# EAGLE design dac-v20_opamp (EAGLE 6.2)
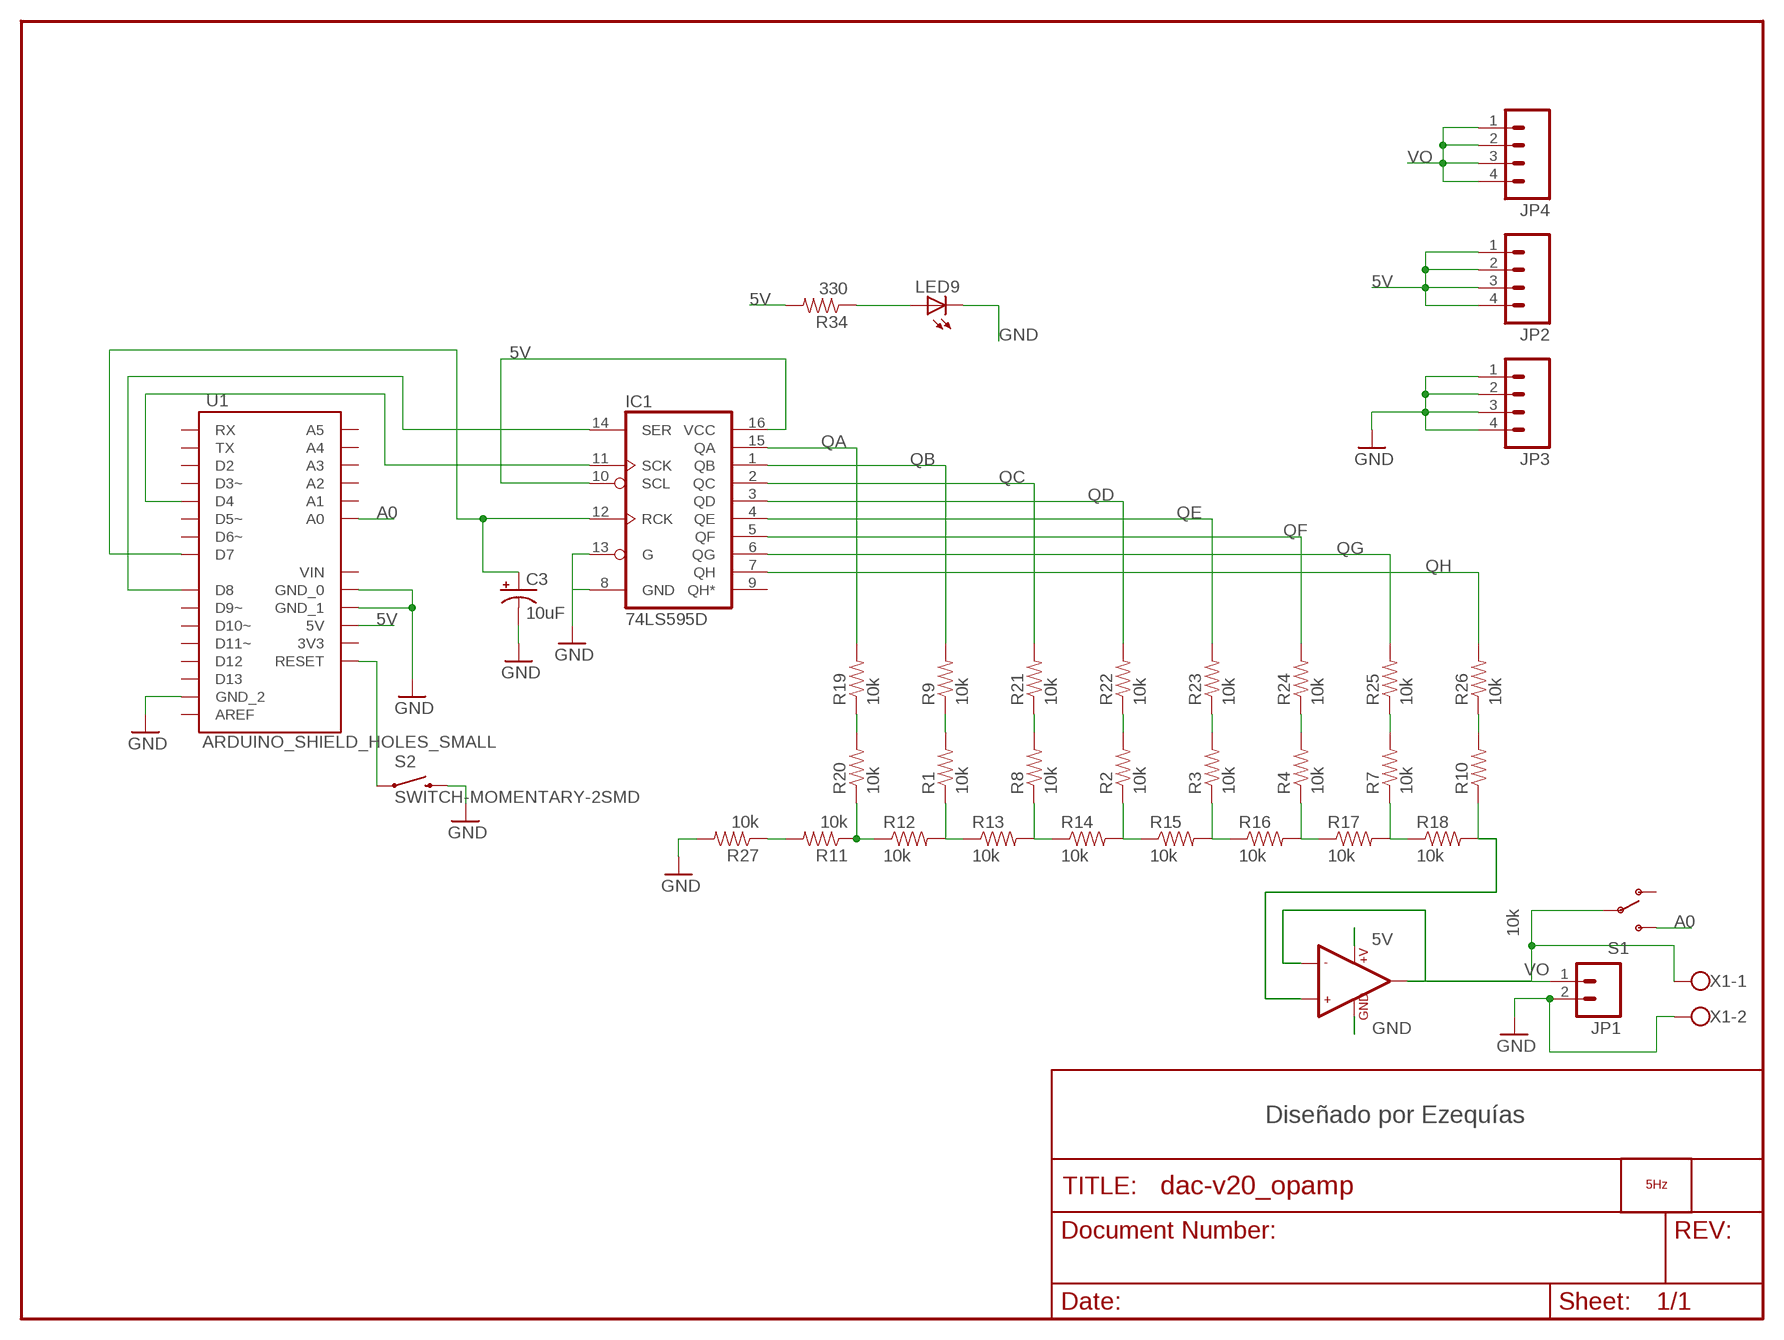
[diagram p0: schematic, sheet 1]

## Parts
C3  10uF  CAP_POL1206  [EIA3216]
IC1  74LS595D  [SO16]
JP1  M02POLAR  [MOLEX-1X2]
JP2  M04PTH  [1X04]
JP3  M04PTH  [1X04]
JP4  M04PTH  [1X04]
LED9  LED0603  [LED-0603]
LOGO2  LOGO_5HZ_H_20MM  [5HZ_LOGO_H_20MM]
R1  10k  RESISTOR0603-RES  [0603-RES]
R2  10k  RESISTOR0603-RES  [0603-RES]
R3  10k  RESISTOR0603-RES  [0603-RES]
R4  10k  RESISTOR0603-RES  [0603-RES]
R7  10k  RESISTOR0603-RES  [0603-RES]
R8  10k  RESISTOR0603-RES  [0603-RES]
R9  10k  RESISTOR0603-RES  [0603-RES]
R10  10k  RESISTOR0603-RES  [0603-RES]
R11  10k  RESISTOR0603-RES  [0603-RES]
R12  10k  RESISTOR0603-RES  [0603-RES]
R13  10k  RESISTOR0603-RES  [0603-RES]
R14  10k  RESISTOR0603-RES  [0603-RES]
R15  10k  RESISTOR0603-RES  [0603-RES]
R16  10k  RESISTOR0603-RES  [0603-RES]
R17  10k  RESISTOR0603-RES  [0603-RES]
R18  10k  RESISTOR0603-RES  [0603-RES]
R19  10k  RESISTOR0603-RES  [0603-RES]
R20  10k  RESISTOR0603-RES  [0603-RES]
R21  10k  RESISTOR0603-RES  [0603-RES]
R22  10k  RESISTOR0603-RES  [0603-RES]
R23  10k  RESISTOR0603-RES  [0603-RES]
R24  10k  RESISTOR0603-RES  [0603-RES]
R25  10k  RESISTOR0603-RES  [0603-RES]
R26  10k  RESISTOR0603-RES  [0603-RES]
R27  10k  RESISTOR0603-RES  [0603-RES]
R34  330  RESISTOR0603-RES  [0603-RES]
S1  SWITCH-SPSTPTH  [SWITCH-SPDT]
S2  SWITCH-MOMENTARY-2SMD  [TACTILE_SWITCH_SMD]
U1  ARDUINO_SHIELD_HOLES_SMALL  [UNO_SHIELD_SMALL_HOLES]
U$1  LMV358  [SO08]
X1  W237-102M2  [W237-102]

## Nets
5V: IC1.10(SCL) IC1.16(VCC) JP2.1 JP2.2 JP2.3 JP2.4 R34.2 U1.5V U$1.8(+V)
A0: S1.3(S) U1.A0
GND: C3.C(-) IC1.8(GND) IC1.13(G) JP1.2 JP3.1 JP3.2 JP3.3 JP3.4 LED9.C R27.2 S2.3 U1.GND_0 U1.GND_1 U1.GND_2 U$1.4(GND) X1.2
N$1: IC1.14(SER) U1.D8
N$2: S2.1 U1.RES(RESET)
N$3: IC1.11(SCK) U1.D4
N$6: C3.A(+) IC1.12(RCK) U1.D7
N$7: LED9.A R34.1
N$9: R10.1 R18.2 U$1.3(+IN1)
N$14: R11.1 R12.1 R20.1
N$15: R1.1 R12.2 R13.1
N$16: R8.1 R13.2 R14.1
N$20: R2.1 R14.2 R15.1
N$22: R3.1 R15.2 R16.1
N$23: R19.1 R20.2
N$24: R1.2 R9.1
N$25: R4.1 R16.2 R17.1
N$26: R8.2 R21.1
N$27: R7.1 R17.2 R18.1
N$29: R10.2 R26.1
N$30: R7.2 R25.1
N$31: R4.2 R24.1
N$32: R3.2 R23.1
N$33: R2.2 R22.1
N$34: R11.2 R27.1
QA: IC1.15(QA) R19.2
QB: IC1.1(QB) R9.2
QC: IC1.2(QC) R21.2
QD: IC1.3(QD) R22.2
QE: IC1.4(QE) R23.2
QF: IC1.5(QF) R24.2
QG: IC1.6(QG) R25.2
QH: IC1.7(QH) R26.2
VO: JP1.1 JP4.1 JP4.2 JP4.3 JP4.4 S1.2(P) U$1.1(OUT1) U$1.2(-IN1) X1.1
Unconnected: IC1.9(QH*) S1.1(O) U1.3.3V(3V3) U1.A1 U1.A2 U1.A3 U1.A4 U1.A5 U1.AREF U1.D2 U1.D3(D3~) U1.D5(D5~) U1.D6(D6~) U1.D9(D9~) U1.D10(D10~) U1.D11(D11~) U1.D12 U1.D13 U1.RX U1.TX U1.VIN U$1.5(+IN2) U$1.6(-IN2) U$1.7(OUT2)

## Notes on the sheet
- Diseñado por Ezequías

## Library data of the parts
C3 = SparkFun:CAP_POL: Capacitor Polarized These are standard SMD and PTH capacitors. Normally 10uF, 47uF, and 100uF in electrolytic and tantalum varieties. Always verify the external diameter of the through hole cap, it varies with capacity, voltage, and manufacturer. The EIA devices should be standard.
IC1 = SparkFun:74*595: 8-bit SHIFT REGISTER, output latch
JP1 = SparkFun:M02: Header 2 Standard 2-pin 0.1" header. Use with straight break away headers (SKU : PRT-00116), right angle break away headers (PRT-00553), swiss pins (PRT-00743), machine pins (PRT-00117), and female headers (PRT-00115). Molex polarized connector foot print use with SKU : PRT-08233 with associated crimp pins and housings.
JP2-JP4 = SparkFun:M04: Header 4 Standard 4-pin 0.1" header. Use with straight break away headers (SKU : PRT-00116), right angle break away headers (PRT-00553), swiss pins (PRT-00743), machine pins (PRT-00117), and female headers (PRT-00115). Molex polarized connector foot print use with SKU : PRT-08231 with associated crimp pins and housings. 1MM SMD Version SKU: PRT-10208
LED9 = SparkFun:LED: LEDs Standard schematic elements and footprints for 5mm, 3mm, 1206, and 0603 sized LEDs. 5mm - Spark Fun Electronics SKU : COM-00529 (and others)
LOGO2 = 5hz-electronica:LOGO_5HZ: Logotipo 5Hz "según Pedro"
R1-R4 R7-R27 R34 = SparkFun:RESISTOR: Resistor Basic schematic elements and footprints for 0603, 1206, and PTH resistors.
S1 = SparkFun:SWITCH-SPST: SPST Switch Simple slide switch. Spark Fun Electronics SKU : COM-00102
S2 = SparkFun:SWITCH-MOMENTARY-2
U1 = 5hz-electronica:ARDUINO_SHIELD
U$1 = memory-atmel-2:LMV358
X1 = PEDRO:W237-102: WAGO SCREW CLAMP; MPN: 237-102; OC_FARNELL: unknown; OC_NEWARK: 70K9898

## Board
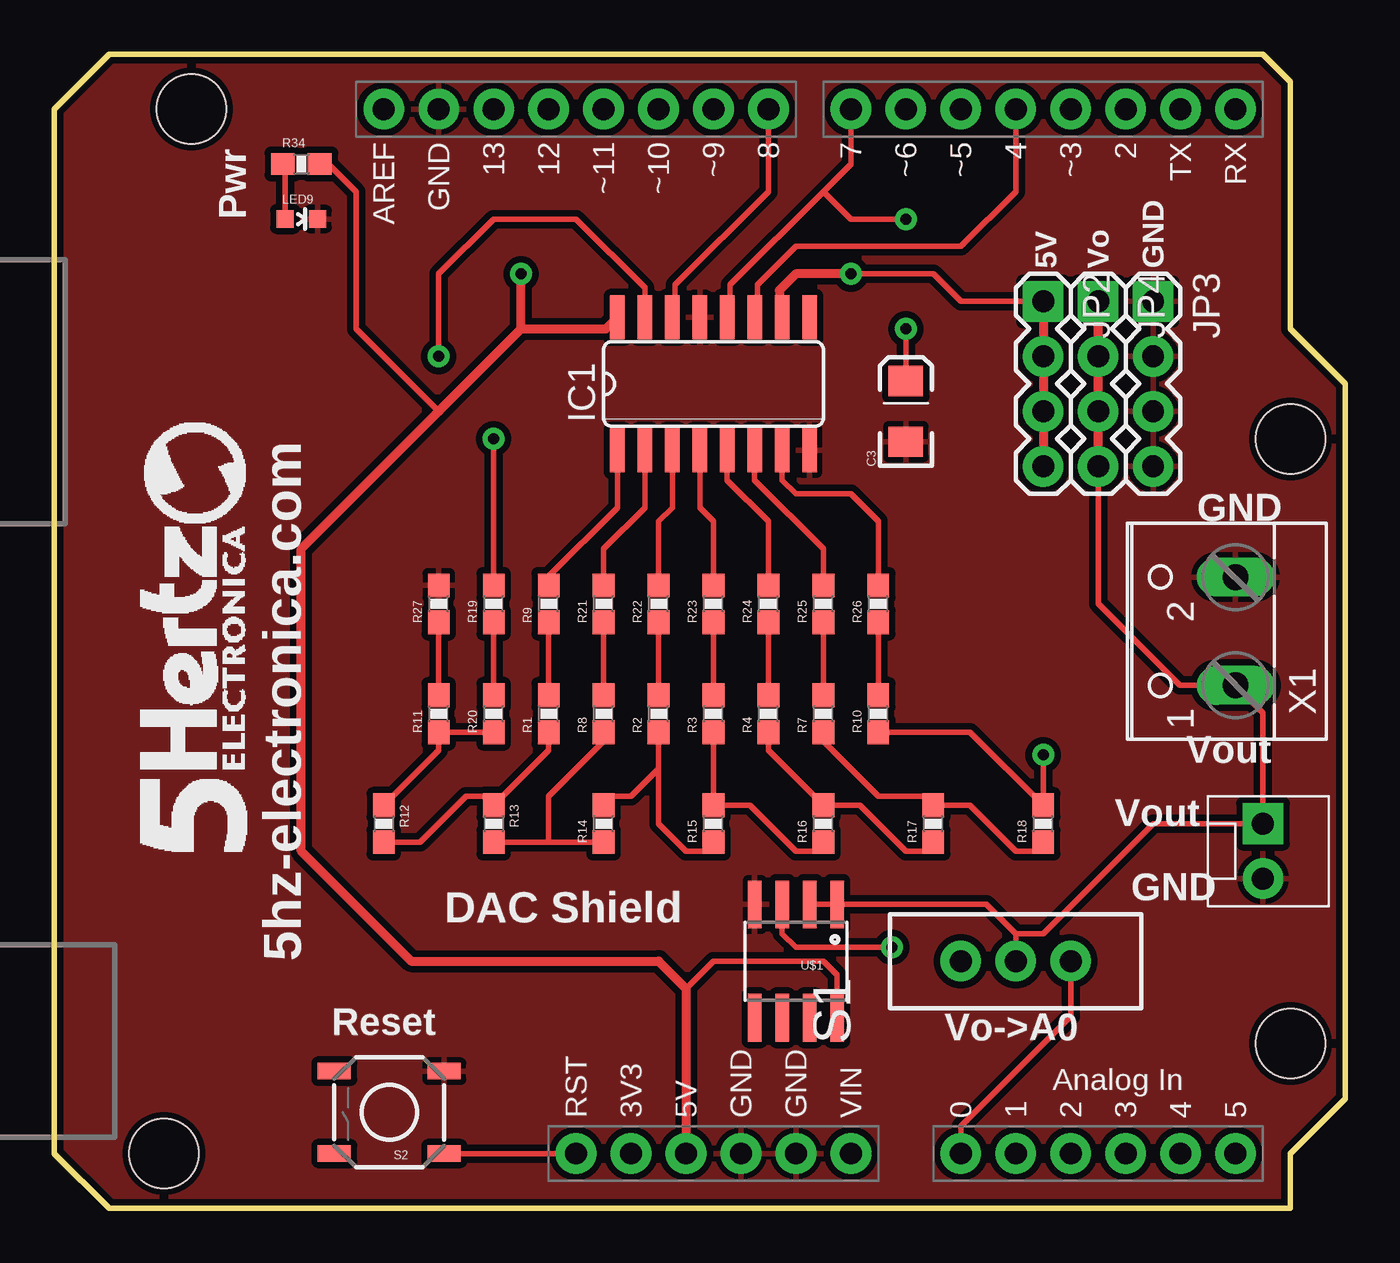
[diagram p1: board, top side]
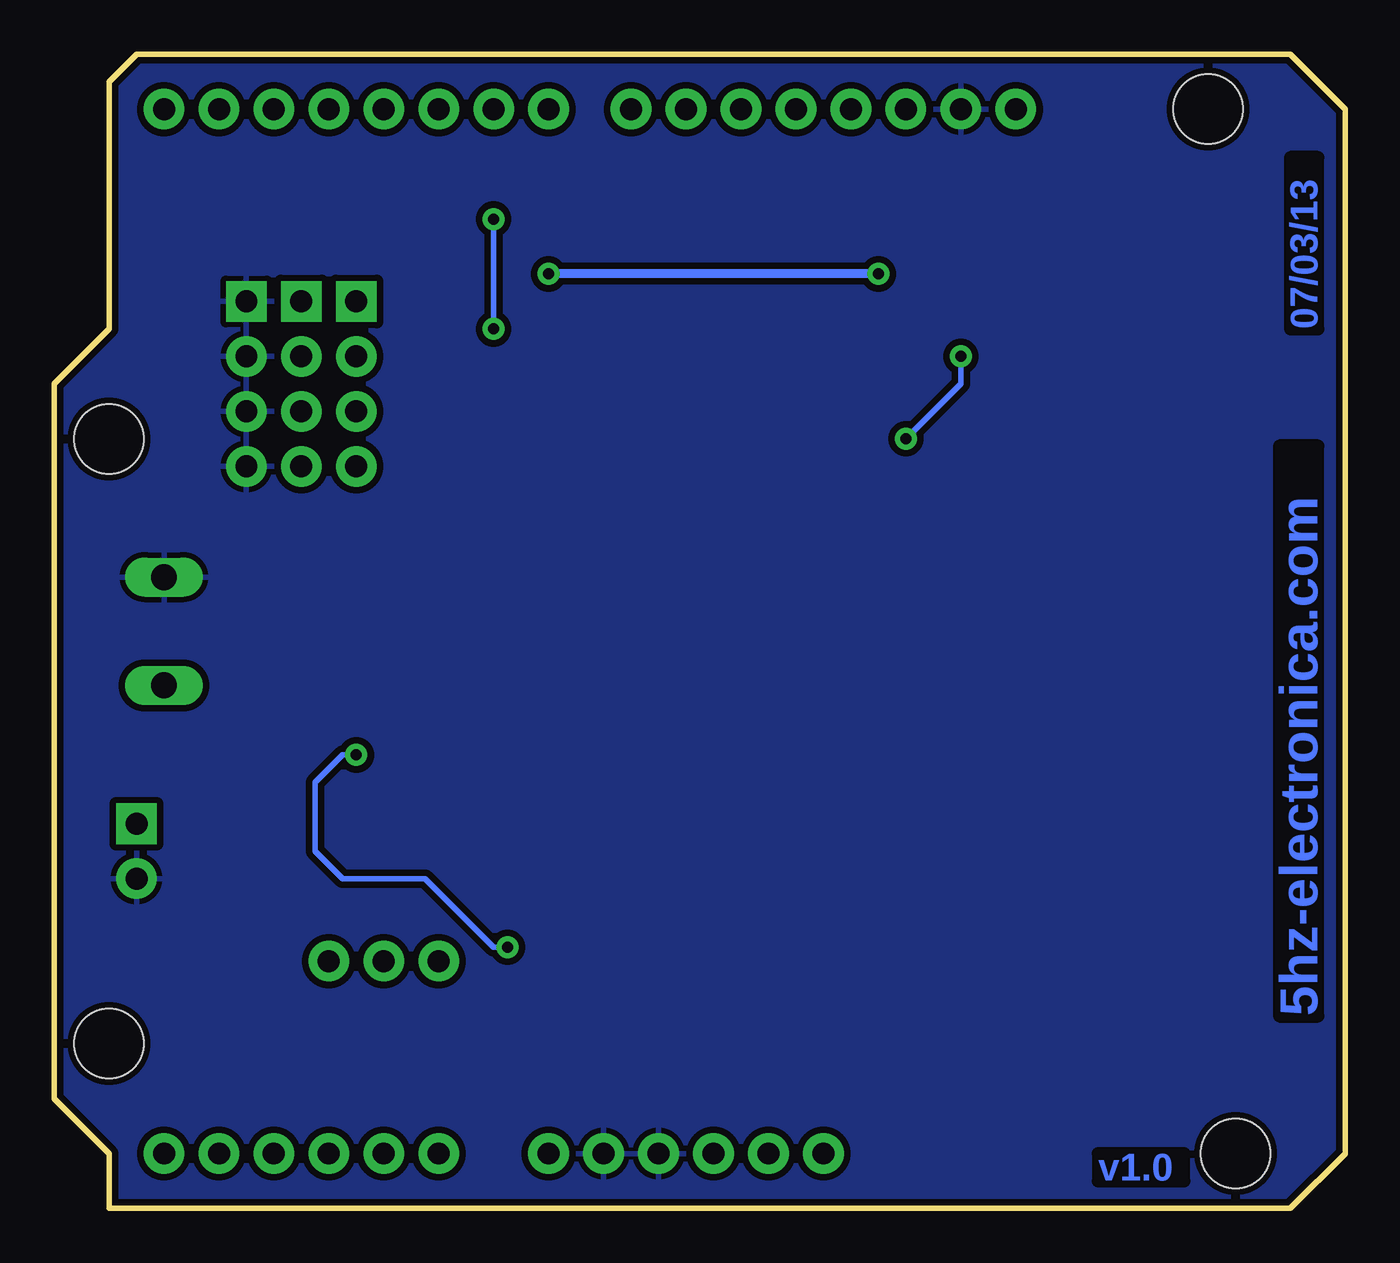
[diagram p2: board, bottom side, seen from below]

Size 59.69 x 53.34 mm. Coordinates in mm from the lower left corner, seen from the top.
Outline: 2.54,53.34 55.88,53.34 57.15,52.07 57.15,40.64 59.69,38.1 59.69,5.08 57.15,2.54 57.15,0 2.54,0 0,2.54 0,50.8 2.54,53.34
Copper layers (1*16): Top 0.035mm / dielectric 1.5mm / Bottom 0.035mm
Design rules: minimum track width 8mil, minimum drill 20mil, track to track 8mil, track to pad 8mil, pad to pad 8mil, via to via 8mil, smd to smd 8mil, copper to edge 10mil, drill to drill 8mil, minimum pad ring 12mil, minimum via ring 10mil, stop-mask expansion 4mil, vias tented up to drill 25mil, thermal gap 10mil

### Footprints (pad centres in the part's own frame; a part is rotated, then mirrored left to right if it is on the bottom)
EIA3216 = smd 1.4 x 1.6: A 1.4,0; C -1.4,0
SO16 = smd 0.66 x 2.032: 1 -4.445,-3.073; 2 -3.175,-3.073; 3 -1.905,-3.073; 4 -0.635,-3.073; 5 0.635,-3.073; 6 1.905,-3.073; 7 3.175,-3.073; 8 4.445,-3.073; 9 4.445,3.073; 10 3.175,3.073; 11 1.905,3.073; 12 0.635,3.073; 13 -0.635,3.073; 14 -1.905,3.073; 15 -3.175,3.073; 16 -4.445,3.073
MOLEX-1X2 = drill 1.016 pad 1.88 square: 1 0,0 | drill 1.016 pad 1.88: 2 2.54,0
1X04 = drill 1.016 pad 1.88 square: 1 0,0 | drill 1.016 pad 1.88: 2 2.54,0; 3 5.08,0; 4 7.62,0
LED-0603 = smd 0.8 x 0.8: A 0,-0.75; C 0,0.75
0603-RES = smd 1.1 x 1: 1 -0.85,0; 2 0.85,0
SWITCH-SPDT = drill 1.016 pad 1.88: 1 0,2.54; 2 0,0; 3 0,-2.54
TACTILE_SWITCH_SMD = smd 1.524 x 0.762: 1 -2.54,1.905; 2 2.54,1.905; 3 -2.54,-1.905; 4 2.54,-1.905
UNO_SHIELD_SMALL_HOLES = drill 1.016 pad 1.88: 3.3V 35.56,2.54; 5V 38.1,2.54; A0 50.8,2.54; A1 53.34,2.54; A2 55.88,2.54; A3 58.42,2.54; A4 60.96,2.54; A5 63.5,2.54; AREF 24.13,50.8; D2 58.42,50.8; D3 55.88,50.8; D4 53.34,50.8; D5 50.8,50.8; D6 48.26,50.8; D7 45.72,50.8; D8 41.91,50.8; D9 39.37,50.8; D10 36.83,50.8; D11 34.29,50.8; D12 31.75,50.8; D13 29.21,50.8; GND_0 43.18,2.54; GND_1 40.64,2.54; GND_2 26.67,50.8; RES 33.02,2.54; RX 63.5,50.8; TX 60.96,50.8; VIN 45.72,2.54 | hole 3.2: 66.04,7.62; 15.24,50.8; 13.97,2.54; 66.04,35.56
SO08 = smd 0.61 x 2.21: 1 -1.905,-2.616; 2 -0.635,-2.616; 3 0.635,-2.616; 4 1.905,-2.616; 5 1.905,2.616; 6 0.635,2.616; 7 -0.635,2.616; 8 -1.905,2.616
W237-102 = drill 1.194 long: 1 -2.5,-1.27; 2 2.5,-1.27

### Placement (x,y rotation side)
C3  39.37,36.83 90 top
IC1  30.48,38.1 0 top
JP1  55.88,17.78 270 top
JP2  45.72,41.91 270 top
JP3  50.8,41.91 270 top
JP4  48.26,41.91 270 top
LED9  11.43,45.72 270 top
LOGO2  8.89,16.51 90 top
R1  22.86,22.86 90 top
R2  27.94,22.86 90 top
R3  30.48,22.86 90 top
R4  33.02,22.86 90 top
R7  35.56,22.86 90 top
R8  25.4,22.86 90 top
R9  22.86,27.94 90 top
R10  38.1,22.86 90 top
R11  17.78,22.86 90 top
R12  15.24,17.78 270 top
R13  20.32,17.78 270 top
R14  25.4,17.78 90 top
R15  30.48,17.78 90 top
R16  35.56,17.78 90 top
R17  40.64,17.78 90 top
R18  45.72,17.78 90 top
R19  20.32,27.94 90 top
R20  20.32,22.86 90 top
R21  25.4,27.94 90 top
R22  27.94,27.94 90 top
R23  30.48,27.94 90 top
R24  33.02,27.94 90 top
R25  35.56,27.94 90 top
R26  38.1,27.94 90 top
R27  17.78,27.94 90 top
R34  11.43,48.26 0 top
S1  44.45,11.43 90 top
S2  15.49,4.45 180 top
U1  -8.89,0 0 top
U$1  34.29,11.43 180 top
X1  53.34,26.67 90 top

### Tracks (layer width: path | path; a pad name or v marks a point on that pad's centre or on a via)
5V  (via drill 0.51)
  Top 0.254: R34.2 12.7,48.26 13.97,46.99 13.97,40.64 17.78,36.83 | v36.83,43.18 40.64,43.18 41.91,41.91 JP2.1 | U$1.8 36.2,10.79 35.56,11.43 30.48,11.43 29.21,10.16
  Top 0.406: U1.5V 29.21,10.16 27.94,11.43 16.51,11.43 11.43,16.51 11.43,30.48 17.78,36.83 21.59,40.64 | 21.59,40.64 25.5,40.64 IC1.16 | 21.59,40.64 v21.59,43.18 | v36.83,43.18 34.29,43.18 33.53,42.42 33.53,41.3 IC1.10 | JP2.1 JP2.2 JP2.3 JP2.4
  Bottom 0.406: v21.59,43.18 v36.83,43.18
A0
  Top 0.254: U1.A0 41.91,3.81 46.99,8.89 S1.3
GND
  pour Top (isolate 0.305): 0,2.54 0,50.8 2.54,53.34 55.88,53.34 57.15,52.07 57.15,40.64 59.69,38.1 59.69,5.08 57.15,2.54 57.15,0 2.54,0
  pour Bottom (isolate 0.305): 0,2.54 0,50.8 2.54,53.34 55.88,53.34 57.15,52.07 57.15,40.64 59.69,38.1 59.69,5.08 57.15,2.54 57.15,0 2.54,0
N$1
  Top 0.254: U1.D8 33.02,46.99 28.7,42.67 28.7,41.3 IC1.14
N$2
  Top 0.254: S2.1 U1.RES
N$3
  Top 0.254: U1.D4 44.45,46.99 41.91,44.45 34.29,44.45 32.51,42.67 32.51,41.3 IC1.11
N$6  (via drill 0.51)
  Top 0.254: U1.D7 36.83,48.26 35.56,46.99 | 35.56,46.99 31.24,42.67 31.24,41.3 IC1.12 | v39.37,40.64 C3.A | v39.37,45.72 36.83,45.72 35.56,46.99
  Bottom 0.254: v39.37,45.72 v39.37,40.64
N$7
  Top 0.254: LED9.A 10.68,48.16 R34.1
N$9  (via drill 0.51)
  Top 0.254: R10.1 42.34,22.01 R18.2 v45.72,20.95 | U$1.3 33.66,12.7 34.29,12.06 v38.73,12.06
  Bottom 0.254: v38.73,12.06 39.37,12.06 42.55,15.24 46.35,15.24 47.62,16.51 47.62,19.68 46.35,20.95 v45.72,20.95
N$14
  Top 0.254: R12.1 17.78,21.17 R11.1 R20.1
N$15
  Top 0.254: R1.1 22.86,21.17 R13.1 19.9,19.05 19.05,19.05 16.93,16.93 R12.2
N$16
  Top 0.254: R13.2 22.86,16.93 | 22.86,16.93 R14.1 | R8.1 25.4,21.59 22.86,19.05 22.86,16.93
N$20
  Top 0.254: 27.94,20.32 R2.1 | 27.94,20.32 26.67,19.05 25.82,19.05 R14.2 | 27.94,20.32 27.94,17.78 29.21,16.51 30.06,16.51 R15.1
N$22
  Top 0.254: R3.1 R15.2 32.17,18.63 34.29,16.51 35.14,16.51 R16.1
N$23
  Top 0.254: R20.2 R19.1
N$24
  Top 0.254: R1.2 R9.1
N$25
  Top 0.254: R4.1 33.02,21.17 R16.2 37.25,18.63 39.37,16.51 40.22,16.51 R17.1
N$26
  Top 0.254: R8.2 R21.1
N$27
  Top 0.254: R7.1 35.56,21.59 38.1,19.05 40.22,19.05 R17.2 42.33,18.63 44.45,16.51 45.3,16.51 R18.1
N$29
  Top 0.254: R10.2 R26.1
N$30
  Top 0.254: R7.2 R25.1
N$31
  Top 0.254: R4.2 R24.1
N$32
  Top 0.254: R3.2 R23.1
N$33
  Top 0.254: R2.2 R22.1
N$34
  Top 0.254: R11.2 R27.1
QA  (via drill 0.51)
  Top 0.254: IC1.15 27.3,42.55 24.13,45.72 20.32,45.72 17.78,43.18 v17.78,39.37 | R19.2 v20.32,35.56
  Bottom 0.254: v17.78,39.37 17.78,38.1 v20.32,35.56
QB
  Top 0.254: IC1.1 26.04,32.38 22.86,29.21 R9.2
QC
  Top 0.254: IC1.2 27.3,32.38 25.4,30.48 R21.2
QD
  Top 0.254: IC1.3 28.57,32.38 27.94,31.75 R22.2
QE
  Top 0.254: IC1.4 29.84,32.38 30.48,31.75 R23.2
QF
  Top 0.254: IC1.5 31.11,33.66 33.02,31.75 R24.2
QG
  Top 0.254: IC1.6 32.38,33.66 35.56,30.48 R25.2
QH
  Top 0.254: IC1.7 33.66,33.66 34.29,33.02 36.83,33.02 38.1,31.75 R26.2
VO
  Top 0.254: U$1.2 U$1.1 43.1,14.05 44.45,12.7 | S1.2 44.45,12.7 | 44.45,12.7 45.72,12.7 50.8,17.78 JP1.1 55.88,22.9 X1.1 52.03,24.17 48.26,27.94 JP4.4
  Top 0.406: JP4.1 JP4.2 JP4.3 JP4.4

### Text on the board
Bottom: 07/03/13 | 5hz-electronica.com | v1.0
tPlace: Pwr | 5V | Vo | GND | GND | Vout | Vout | GND | DAC Shield | 5hz-electronica.com | Reset | Vo->A0